# Altium schematic sheet Sheet1.SchDoc
size A4
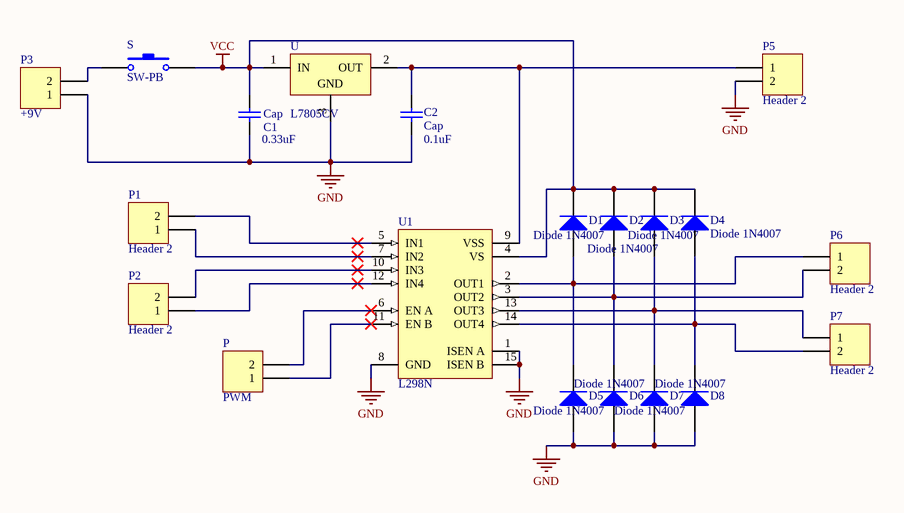
[diagram p0: Sheet1.SchDoc]

## Parts
C1  Cap  value 0.33uF  [RAD-0.3]
C2  Cap  value 0.1uF  [RAD-0.3]
D1  Diode 1N4007  [DO-41]
D2  Diode 1N4007  [DO-41]
D3  Diode 1N4007  [DO-41]
D4  Diode 1N4007  [DO-41]
D5  Diode 1N4007  [DO-41]
D6  Diode 1N4007  [DO-41]
D7  Diode 1N4007  [DO-41]
D8  Diode 1N4007  [DO-41]
P  PWM  [header]
P1  Header 2  [header]
P2  Header 2  [header]
P3  +9V  [header]
P5  Header 2  [header]
P6  Header 2  [header]
P7  Header 2  [header]
S  SW-PB  [SPST-2]
U  L7805CV  [TO220ABN]
U1  L298N  [Multiwatt15V]

## Nets
GND: C1.1 C2.1 D5.1(A) D6.1(A) D7.1(A) D8.1(A) P3.1 P5.2 U.3(GND) U1.1(ISEN_A) U1.8(GND) U1.15(ISEN_B)
VCC: C1.2 D1.2(K) D2.2(K) D3.2(K) D4.2(K) S.2 U.1(IN) U1.4(VS)
NetC2_2: C2.2 P5.1 U.2(OUT) U1.9(VSS)
NetD1_1: D1.1(A) D5.2(K) P6.1 U1.2(OUT1)
NetD2_1: D2.1(A) D6.2(K) P6.2 U1.3(OUT2)
NetD3_1: D3.1(A) D7.2(K) P7.1 U1.13(OUT3)
NetD4_1: D4.1(A) D8.2(K) P7.2 U1.14(OUT4)
NetP1_1: P1.1 U1.7(IN2)
NetP1_2: P1.2 U1.5(IN1)
NetP2_1: P2.1 U1.12(IN4)
NetP2_2: P2.2 U1.10(IN3)
NetP3_2: P3.2 S.1
NetP_1: P.1 U1.11(EN_B)
NetP_2: P.2 U1.6(EN_A)

## Library data of the parts
C1 C2 = Cap: Capacitor; Published: 8-Jun-2000; LatestRevisionDate: 17-Jul-2002; LatestRevisionNote: Re-released for DXP Platform.; PackageReference: RAD-0.3; Publisher: Altium Limited; PackageDescription: Radial Cap, Thru-Hole; 2 Leads; 0.3 in Pin Spacing
D1-D8 = Diode 1N4007: 1 Amp General Purpose Rectifier; Published: 8-Jun-2000; LatestRevisionDate: 17-Jul-2002; LatestRevisionNote: Re-released for DXP Platform.; DatasheetVersion: 1998; PackageVersion: Aug-1999; PackageReference: DO-41; Publisher: Altium Limited; PackageDescription: Diode, Axial; Body 5.2 x 2.7 mm (LxDia. max), Lead Dia. 0.86 mm (max); Code_JEDEC: DO-204-AL; ComponentLink1Description: Manufacturer Link; ComponentLink1URL: http://www.fairchildsemi.com/; ComponentLink2Description: Datasheet; ComponentLink2URL: http://www.fairchildsemi.com/ds/1N%2F1N4001.pdf
P P1-P3 P5-P7 = Header 2: Header, 2-Pin; LatestRevisionDate: 17-Jul-2002; LatestRevisionNote: Re-released for DXP Platform.; Publisher: Altium Limited
S = SW-PB: Switch; Published: 24-Mar-1999; LatestRevisionDate: 17-Jul-2002; LatestRevisionNote: Re-released for DXP Platform.; PackageReference: SPST-2; Publisher: Altium Limited; PackageDescription: Switch; 2 Leads
U = L7805CV: Positive Voltage Regulator; Note: Tab is connected to pin 3 (GND).; Published: 24-Aug-2001; LatestRevisionDate: 17-Jul-2002; LatestRevisionNote: Re-released for DXP Platform.; DatasheetVersion: Dec-1998; PackageVersion: Jun-1998; PackageReference: TO220ABN; Publisher: Altium Limited; PackageDescription: TO, Thru-Hole, Vertical, Heatsink Mounted; 3 In-Line Leads; Pitch 2.54 mm; Pin sequence 1, 3, 2; ComponentLink1Description: Manufacturer Link; ComponentLink1URL: http://www.st.com/
U1 = L298N: Dual Full Bridge Driver; Published: 8-Jun-2000; LatestRevisionDate: 14-May-2007; LatestRevisionNote: Mapped to vertical PCB.; DatasheetVersion: Jul-1999; PackageReference: Multiwatt15V; Publisher: Altium Limited; PackageDescription: TO, Thru-Hole, Vertical, Heatsink Mounted; 15 Bent Staggered Leads; Pitch 1.27 mm; ComponentLink1Description: Manufacturer Link; ComponentLink1URL: http://www.st.com/; ComponentLink2Description: Datasheet; ComponentLink2URL: http://www.st.com/stonline/products/literature/ds/1773/l298.pdf